# Altium schematic sheet USB_HOST.SchDoc
size A4; SheetNumber: 5; SheetTotal: 6
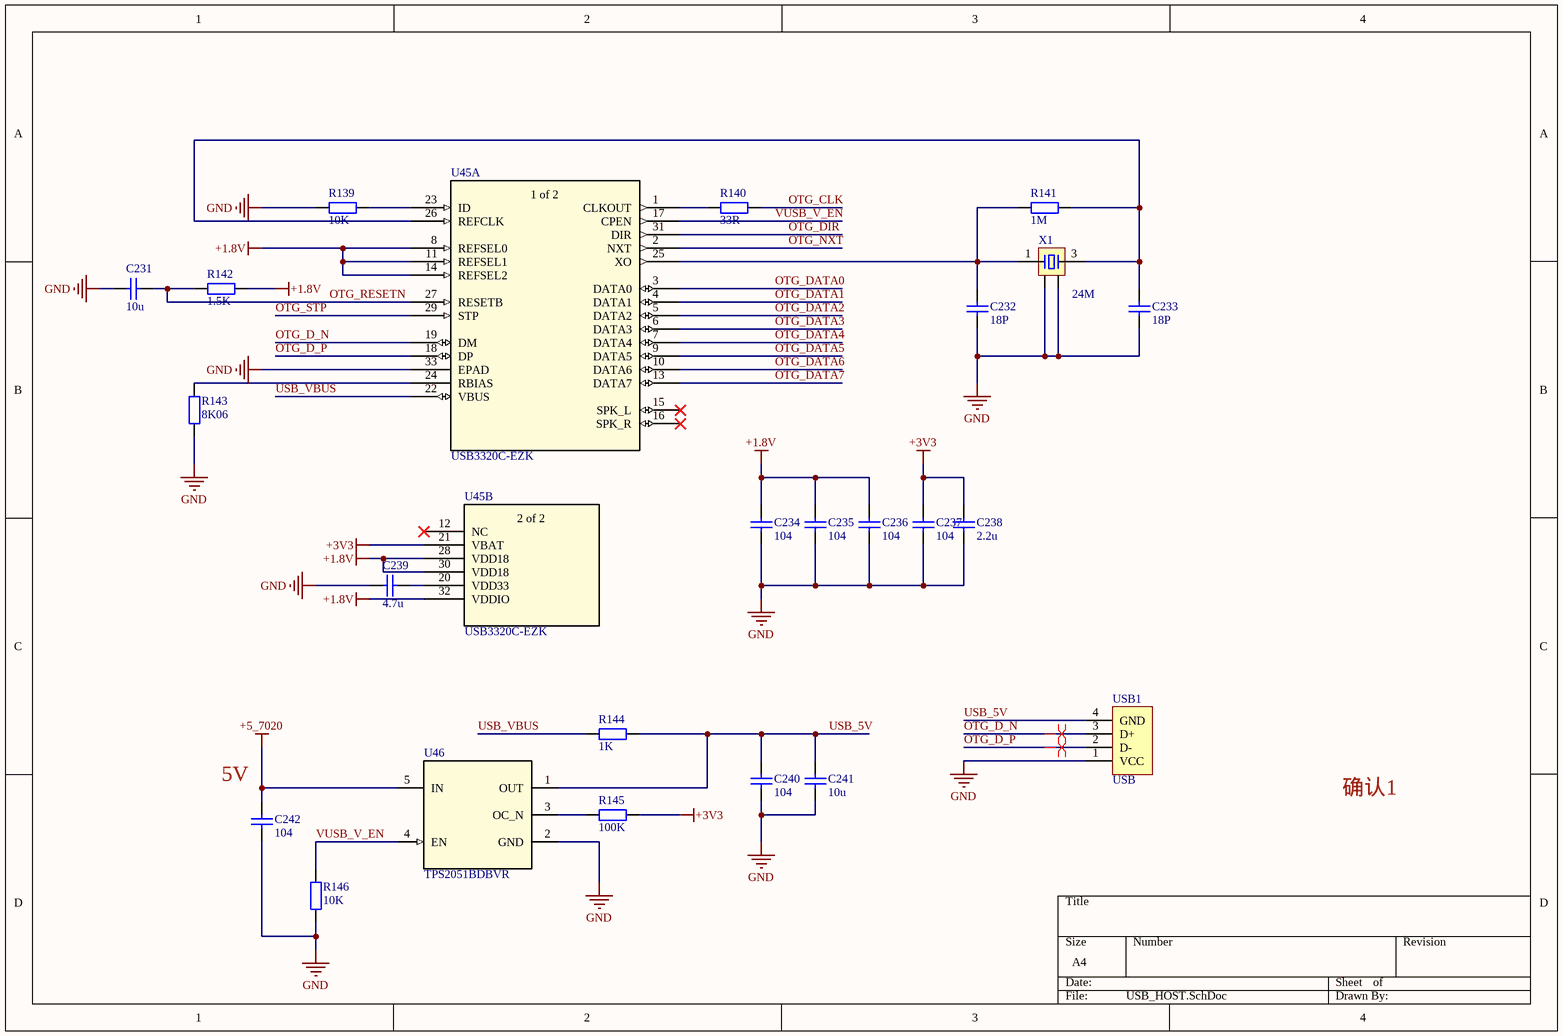
[diagram p0: USB_HOST.SchDoc]

## Parts
C231  10u  [C0402_L]
C232  18P  [C0402_L]
C233  18P  [C0402_L]
C234  104  [C0402_L]
C235  104  [C0402_L]
C236  104  [C0402_L]
C237  104  [C0402_L]
C238  2.2u  [C0402_L]
C239  4.7u  [C0402_L]
C240  104  [C0402_L]
C241  10u  [C0402_L]
C242  104  [C0402_L]
R139  10K  [R0402_L]
R140  33R  [R0402_L]
R141  1M  [R0402_L]
R142  1.5K  [R0402_L]
R143  8K06  [R0402_L]
R144  1K  [R0402_L]
R145  100K  [R0402_L]
R146  10K  [R0402_L]
U45  USB3320C-EZK  [QFN32_5X5MC_MCH]  (parts A,B of 2)
U46  TPS2051BDBVR  [DBV0005A_N]
USB1  USB  [USB2.0_Type-A_DIP_F_3]
X1  24M  [XTAL-2025-4P]

## Nets
+1.8V: C234.2 C235.2 C236.2 R142.2 U45.8(REFSEL0) U45.11(REFSEL1) U45.14(REFSEL2) U45.28(VDD18) U45.30(VDD18) U45.32(VDDIO)
+3V3: C237.2 C238.2 R145.1 U45.21(VBAT)
+5_7020: C242.2 U46.5(IN)
GND: C231.1 C232.1 C233.1 C234.1 C235.1 C236.1 C237.1 C238.1 C239.1 C240.1 C241.1 C242.1 R139.2 R143.1 R146.2 U45.33(EPAD) U46.2(GND) USB1.1(VCC) X1.2 X1.4
OTG_CLK: R140.1
OTG_D_N: U45.19(DM) USB1.3(D+)
OTG_D_P: U45.18(DP) USB1.2(D-)
OTG_DATA0: U45.3(DATA0)
OTG_DATA1: U45.4(DATA1)
OTG_DATA2: U45.5(DATA2)
OTG_DATA3: U45.6(DATA3)
OTG_DATA4: U45.7(DATA4)
OTG_DATA5: U45.9(DATA5)
OTG_DATA6: U45.10(DATA6)
OTG_DATA7: U45.13(DATA7)
OTG_DIR: U45.31(DIR)
OTG_NXT: U45.2(NXT)
OTG_RESETN: C231.2 R142.1 U45.27(RESETB)
OTG_STP: U45.29(STP)
USB_5V: C240.2 C241.2 R144.1 U46.1(OUT) USB1.4(GND)
USB_VBUS: R144.2 U45.22(VBUS)
VUSB_V_EN: R146.1 U45.17(CPEN) U46.4(EN)
NetC232_2: C232.2 R141.2 U45.25(XO) X1.1
NetC233_2: C233.2 R141.1 U45.26(REFCLK) X1.3
NetC239_2: C239.2 U45.20(VDD33)
NetR139_1: R139.1 U45.23(ID)
NetR140_2: R140.2 U45.1(CLKOUT)
NetR143_2: R143.2 U45.24(RBIAS)
NetR145_2: R145.2 U46.3(OC_N)

Not connected (* = marked no-connect by the designer): U45 12(NC)* 15(SPK_L)* 16(SPK_R)*

## Layout directives
differential pair: OTG_D_N, OTG_D_P

## Notes on the sheet
- (near C242) 5V
- 确认1
- (in symbol USB3320C-EZK, part A) 1 of 2
- (in symbol USB3320C-EZK, part B) 2 of 2

## Library data of the parts
C231-C242 = C: 贴片电容/MLCC电容; BOM名称: 无极性贴片电容; 当前库版本V2023.5.31 @淘宝卖家:黄晶宝石: 最新版本发布https://item.taobao.com/item.htm?id=566775463719
R139-R146 = R: 贴片电阻; 联系下单店铺卖家 免费帮你查找封装: 联系下单店铺卖家 免费技术支持; BOM名称: 贴片电阻
U45 = USB3320C-EZK: No Description Available; Mfr_Name: Microchip; RefDes: RefDes; Type: Type
U46 = TPS2051BDBVR: No Description Available; Mfr_Name: Texas Instruments; Alternate_PartNumber: TPS2051BDBVT; CompType: IC; TYPE: TYPE; RefDes: RefDes; Application_BuildNumber: *; PartNumber: TPS2051BDBVR; PackageReference: DBV0005A; MountType: SMT; RoHS: Y; Manufacturer: Texas Instruments
USB1 = USB2.0_Type-A_F: USB2.0_Type-A母座; 联系下单店铺卖家 免费技术支持: 联系下单店铺卖家 免费帮你查找封装; BOM名称: USB2.0_Type-A母座
X1 = XTAL-4P: 4脚无源晶振(谐振器）; 联系下单店铺卖家 免费帮你查找封装: 联系下单店铺卖家 免费技术支持; BOM名称: 4脚无源晶振(谐振器）